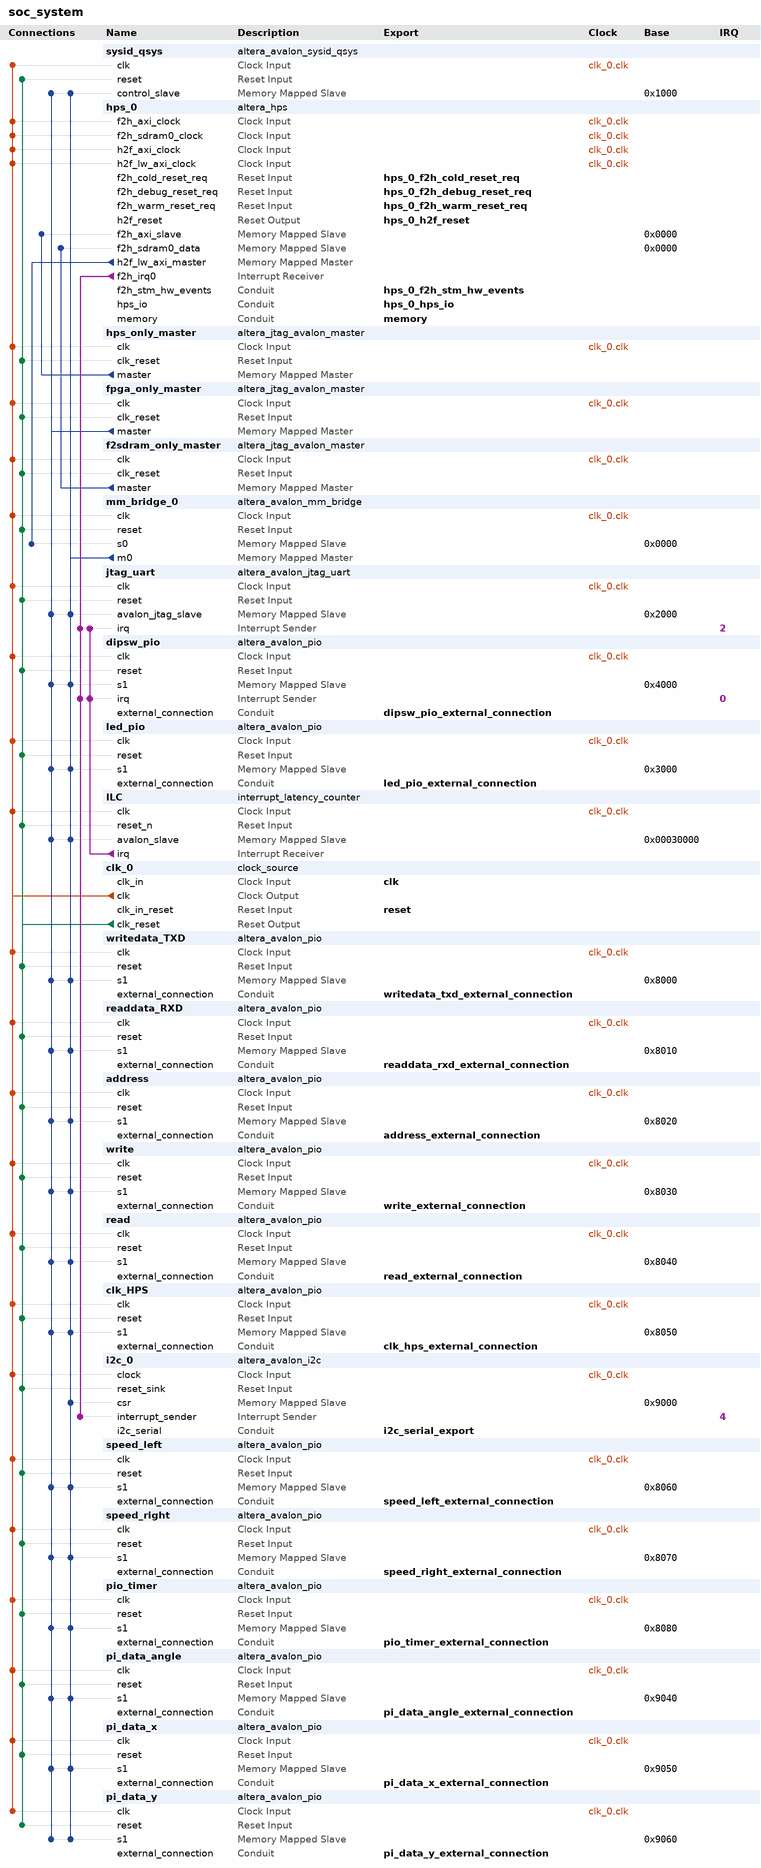
[diagram p0: system contents]
# Platform Designer (Qsys) system soc_system, Cyclone V 5CSEBA6U23I7
# Parameters at their usual value, and those the tool derives, are not listed.
package require -exact qsys 18.1
create_system soc_system
set_project_property DEVICE_FAMILY {Cyclone V}
set_project_property DEVICE 5CSEBA6U23I7

add_instance sysid_qsys altera_avalon_sysid_qsys 18.1
set_instance_parameter_value sysid_qsys id -1395322110

add_instance hps_0 altera_hps 18.1
set_instance_parameter_value hps_0 EMAC1_Mode RGMII
set_instance_parameter_value hps_0 EMAC1_PinMuxing {HPS I/O Set 0}
set_instance_parameter_value hps_0 F2SCLK_COLDRST_Enable true
set_instance_parameter_value hps_0 F2SCLK_DBGRST_Enable true
set_instance_parameter_value hps_0 F2SCLK_WARMRST_Enable true
set_instance_parameter_value hps_0 F2SDRAM_Type {Avalon-MM Bidirectional}
set_instance_parameter_value hps_0 F2SDRAM_Width 256
set_instance_parameter_value hps_0 F2SINTERRUPT_Enable true
set_instance_parameter_value hps_0 F2S_Width 2
set_instance_parameter_value hps_0 FPGA_PERIPHERAL_OUTPUT_CLOCK_FREQ_EMAC0_GTX_CLK 100
set_instance_parameter_value hps_0 FPGA_PERIPHERAL_OUTPUT_CLOCK_FREQ_EMAC0_MD_CLK 100.0
set_instance_parameter_value hps_0 FPGA_PERIPHERAL_OUTPUT_CLOCK_FREQ_EMAC1_GTX_CLK 100
set_instance_parameter_value hps_0 FPGA_PERIPHERAL_OUTPUT_CLOCK_FREQ_EMAC1_MD_CLK 100.0
set_instance_parameter_value hps_0 HPS_PROTOCOL DDR3
set_instance_parameter_value hps_0 I2C0_Mode I2C
set_instance_parameter_value hps_0 I2C0_PinMuxing {HPS I/O Set 0}
set_instance_parameter_value hps_0 I2C1_Mode I2C
set_instance_parameter_value hps_0 I2C1_PinMuxing {HPS I/O Set 0}
set_instance_parameter_value hps_0 LWH2F_Enable true
set_instance_parameter_value hps_0 MEM_BANKADDR_WIDTH 3
set_instance_parameter_value hps_0 MEM_CLK_FREQ 400.0
set_instance_parameter_value hps_0 MEM_COL_ADDR_WIDTH 10
set_instance_parameter_value hps_0 MEM_DQ_WIDTH 32
set_instance_parameter_value hps_0 MEM_DRV_STR RZQ/6
set_instance_parameter_value hps_0 MEM_ROW_ADDR_WIDTH 15
set_instance_parameter_value hps_0 MEM_RTT_NOM RZQ/6
set_instance_parameter_value hps_0 MEM_RTT_WR {Dynamic ODT off}
set_instance_parameter_value hps_0 MEM_TCL 7
set_instance_parameter_value hps_0 MEM_TFAW_NS 37.5
set_instance_parameter_value hps_0 MEM_TRAS_NS 35.0
set_instance_parameter_value hps_0 MEM_TRCD_NS 13.75
set_instance_parameter_value hps_0 MEM_TRFC_NS 300.0
set_instance_parameter_value hps_0 MEM_TRP_NS 13.75
set_instance_parameter_value hps_0 MEM_VENDOR Other
set_instance_parameter_value hps_0 MEM_WTCL 7
set_instance_parameter_value hps_0 QSPI_Mode N/A
set_instance_parameter_value hps_0 QSPI_PinMuxing Unused
set_instance_parameter_value hps_0 REF_CLK_FREQ 25.0
set_instance_parameter_value hps_0 S2FCLK_USER2CLK 4
set_instance_parameter_value hps_0 S2F_Width 2
set_instance_parameter_value hps_0 SDIO_Mode {4-bit Data}
set_instance_parameter_value hps_0 SDIO_PinMuxing {HPS I/O Set 0}
set_instance_parameter_value hps_0 SPIM1_Mode {Single Slave Select}
set_instance_parameter_value hps_0 SPIM1_PinMuxing {HPS I/O Set 0}
set_instance_parameter_value hps_0 STM_Enable true
set_instance_parameter_value hps_0 TIMING_BOARD_AC_SKEW 0.02
set_instance_parameter_value hps_0 TIMING_BOARD_AC_TO_CK_SKEW 0.0
set_instance_parameter_value hps_0 TIMING_BOARD_DQ_TO_DQS_SKEW 0.0
set_instance_parameter_value hps_0 TIMING_BOARD_MAX_CK_DELAY 0.6
set_instance_parameter_value hps_0 TIMING_BOARD_MAX_DQS_DELAY 0.6
set_instance_parameter_value hps_0 TIMING_BOARD_SKEW_BETWEEN_DQS 0.02
set_instance_parameter_value hps_0 TIMING_BOARD_SKEW_CKDQS_DIMM_MAX 0.01
set_instance_parameter_value hps_0 TIMING_BOARD_SKEW_CKDQS_DIMM_MIN -0.01
set_instance_parameter_value hps_0 TIMING_BOARD_SKEW_WITHIN_DQS 0.02
set_instance_parameter_value hps_0 TIMING_TDH 125
set_instance_parameter_value hps_0 TIMING_TDQSCK 400
set_instance_parameter_value hps_0 TIMING_TDQSQ 120
set_instance_parameter_value hps_0 TIMING_TDS 50
set_instance_parameter_value hps_0 TIMING_TIH 250
set_instance_parameter_value hps_0 TIMING_TIS 175
set_instance_parameter_value hps_0 TIMING_TQSH 0.38
set_instance_parameter_value hps_0 UART0_Mode {No Flow Control}
set_instance_parameter_value hps_0 UART0_PinMuxing {HPS I/O Set 0}
set_instance_parameter_value hps_0 USB1_Mode SDR
set_instance_parameter_value hps_0 USB1_PinMuxing {HPS I/O Set 0}
set_instance_parameter_value hps_0 desired_cfg_clk_mhz 100.0
set_instance_parameter_value hps_0 desired_qspi_clk_mhz 370.0

add_instance hps_only_master altera_jtag_avalon_master 18.1

add_instance fpga_only_master altera_jtag_avalon_master 18.1

add_instance f2sdram_only_master altera_jtag_avalon_master 18.1

add_instance mm_bridge_0 altera_avalon_mm_bridge 18.1
set_instance_parameter_value mm_bridge_0 ADDRESS_UNITS SYMBOLS
set_instance_parameter_value mm_bridge_0 ADDRESS_WIDTH 10
set_instance_parameter_value mm_bridge_0 DATA_WIDTH 32
set_instance_parameter_value mm_bridge_0 MAX_PENDING_RESPONSES 4
set_instance_parameter_value mm_bridge_0 USE_AUTO_ADDRESS_WIDTH 1

add_instance jtag_uart altera_avalon_jtag_uart 18.1
set_instance_parameter_value jtag_uart allowMultipleConnections true
set_instance_parameter_value jtag_uart simInteractiveOptions INTERACTIVE_ASCII_OUTPUT

add_instance dipsw_pio altera_avalon_pio 18.1
set_instance_parameter_value dipsw_pio bitClearingEdgeCapReg true
set_instance_parameter_value dipsw_pio captureEdge true
set_instance_parameter_value dipsw_pio direction Input
set_instance_parameter_value dipsw_pio edgeType ANY
set_instance_parameter_value dipsw_pio generateIRQ true
set_instance_parameter_value dipsw_pio irqType EDGE
set_instance_parameter_value dipsw_pio width 4

add_instance led_pio altera_avalon_pio 18.1
set_instance_parameter_value led_pio direction Output
set_instance_parameter_value led_pio resetValue 127
set_instance_parameter_value led_pio width 7

add_instance ILC interrupt_latency_counter 18.1
set_instance_parameter_value ILC IRQ_PORT_CNT 4

add_instance clk_0 clock_source 18.1
set_instance_parameter_value clk_0 clockFrequency 50000000

add_instance writedata_TXD altera_avalon_pio 18.1
set_instance_parameter_value writedata_TXD direction Output
set_instance_parameter_value writedata_TXD width 32

add_instance readdata_RXD altera_avalon_pio 18.1
set_instance_parameter_value readdata_RXD direction Input
set_instance_parameter_value readdata_RXD width 32

add_instance address altera_avalon_pio 18.1
set_instance_parameter_value address direction Output
set_instance_parameter_value address width 3

add_instance write altera_avalon_pio 18.1
set_instance_parameter_value write direction Output
set_instance_parameter_value write width 1

add_instance read altera_avalon_pio 18.1
set_instance_parameter_value read direction Output
set_instance_parameter_value read width 1

add_instance clk_HPS altera_avalon_pio 18.1
set_instance_parameter_value clk_HPS direction Output
set_instance_parameter_value clk_HPS width 1

add_instance i2c_0 altera_avalon_i2c 18.1
set_instance_parameter_value i2c_0 FIFO_DEPTH 4

add_instance speed_left altera_avalon_pio 18.1
set_instance_parameter_value speed_left direction Input
set_instance_parameter_value speed_left width 32

add_instance speed_right altera_avalon_pio 18.1
set_instance_parameter_value speed_right direction Input
set_instance_parameter_value speed_right width 32

add_instance pio_timer altera_avalon_pio 18.1
set_instance_parameter_value pio_timer direction Input
set_instance_parameter_value pio_timer width 32

add_instance pi_data_angle altera_avalon_pio 18.1
set_instance_parameter_value pi_data_angle direction Input
set_instance_parameter_value pi_data_angle width 32

add_instance pi_data_x altera_avalon_pio 18.1
set_instance_parameter_value pi_data_x direction Input
set_instance_parameter_value pi_data_x width 32

add_instance pi_data_y altera_avalon_pio 18.1
set_instance_parameter_value pi_data_y direction Input
set_instance_parameter_value pi_data_y width 32

# connections
add_connection clk_0.clk address.clk clock
add_connection clk_0.clk clk_HPS.clk clock
add_connection clk_0.clk dipsw_pio.clk clock
add_connection clk_0.clk f2sdram_only_master.clk clock
add_connection clk_0.clk fpga_only_master.clk clock
add_connection clk_0.clk hps_0.f2h_axi_clock clock
add_connection clk_0.clk hps_0.f2h_sdram0_clock clock
add_connection clk_0.clk hps_0.h2f_axi_clock clock
add_connection clk_0.clk hps_0.h2f_lw_axi_clock clock
add_connection clk_0.clk hps_only_master.clk clock
add_connection clk_0.clk i2c_0.clock clock
add_connection clk_0.clk ILC.clk clock
add_connection clk_0.clk jtag_uart.clk clock
add_connection clk_0.clk led_pio.clk clock
add_connection clk_0.clk mm_bridge_0.clk clock
add_connection clk_0.clk pi_data_angle.clk clock
add_connection clk_0.clk pi_data_x.clk clock
add_connection clk_0.clk pi_data_y.clk clock
add_connection clk_0.clk pio_timer.clk clock
add_connection clk_0.clk read.clk clock
add_connection clk_0.clk readdata_RXD.clk clock
add_connection clk_0.clk speed_left.clk clock
add_connection clk_0.clk speed_right.clk clock
add_connection clk_0.clk sysid_qsys.clk clock
add_connection clk_0.clk write.clk clock
add_connection clk_0.clk writedata_TXD.clk clock
add_connection clk_0.clk_reset address.reset reset
add_connection clk_0.clk_reset clk_HPS.reset reset
add_connection clk_0.clk_reset dipsw_pio.reset reset
add_connection clk_0.clk_reset f2sdram_only_master.clk_reset reset
add_connection clk_0.clk_reset fpga_only_master.clk_reset reset
add_connection clk_0.clk_reset hps_only_master.clk_reset reset
add_connection clk_0.clk_reset i2c_0.reset_sink reset
add_connection clk_0.clk_reset ILC.reset_n reset
add_connection clk_0.clk_reset jtag_uart.reset reset
add_connection clk_0.clk_reset led_pio.reset reset
add_connection clk_0.clk_reset mm_bridge_0.reset reset
add_connection clk_0.clk_reset pi_data_angle.reset reset
add_connection clk_0.clk_reset pi_data_x.reset reset
add_connection clk_0.clk_reset pi_data_y.reset reset
add_connection clk_0.clk_reset pio_timer.reset reset
add_connection clk_0.clk_reset read.reset reset
add_connection clk_0.clk_reset readdata_RXD.reset reset
add_connection clk_0.clk_reset speed_left.reset reset
add_connection clk_0.clk_reset speed_right.reset reset
add_connection clk_0.clk_reset sysid_qsys.reset reset
add_connection clk_0.clk_reset write.reset reset
add_connection clk_0.clk_reset writedata_TXD.reset reset
add_connection f2sdram_only_master.master hps_0.f2h_sdram0_data avalon
set_connection_parameter_value f2sdram_only_master.master/hps_0.f2h_sdram0_data baseAddress 0x0000
add_connection fpga_only_master.master address.s1 avalon
set_connection_parameter_value fpga_only_master.master/address.s1 baseAddress 0x8020
add_connection fpga_only_master.master clk_HPS.s1 avalon
set_connection_parameter_value fpga_only_master.master/clk_HPS.s1 baseAddress 0x8050
add_connection fpga_only_master.master dipsw_pio.s1 avalon
set_connection_parameter_value fpga_only_master.master/dipsw_pio.s1 baseAddress 0x4000
add_connection fpga_only_master.master ILC.avalon_slave avalon
set_connection_parameter_value fpga_only_master.master/ILC.avalon_slave baseAddress 0x00030000
add_connection fpga_only_master.master jtag_uart.avalon_jtag_slave avalon
set_connection_parameter_value fpga_only_master.master/jtag_uart.avalon_jtag_slave baseAddress 0x2000
add_connection fpga_only_master.master led_pio.s1 avalon
set_connection_parameter_value fpga_only_master.master/led_pio.s1 baseAddress 0x3000
add_connection fpga_only_master.master pi_data_angle.s1 avalon
set_connection_parameter_value fpga_only_master.master/pi_data_angle.s1 baseAddress 0x9040
add_connection fpga_only_master.master pi_data_x.s1 avalon
set_connection_parameter_value fpga_only_master.master/pi_data_x.s1 baseAddress 0x9050
add_connection fpga_only_master.master pi_data_y.s1 avalon
set_connection_parameter_value fpga_only_master.master/pi_data_y.s1 baseAddress 0x9060
add_connection fpga_only_master.master pio_timer.s1 avalon
set_connection_parameter_value fpga_only_master.master/pio_timer.s1 baseAddress 0x8080
add_connection fpga_only_master.master read.s1 avalon
set_connection_parameter_value fpga_only_master.master/read.s1 baseAddress 0x8040
add_connection fpga_only_master.master readdata_RXD.s1 avalon
set_connection_parameter_value fpga_only_master.master/readdata_RXD.s1 baseAddress 0x8010
add_connection fpga_only_master.master speed_left.s1 avalon
set_connection_parameter_value fpga_only_master.master/speed_left.s1 baseAddress 0x8060
add_connection fpga_only_master.master speed_right.s1 avalon
set_connection_parameter_value fpga_only_master.master/speed_right.s1 baseAddress 0x8070
add_connection fpga_only_master.master sysid_qsys.control_slave avalon
set_connection_parameter_value fpga_only_master.master/sysid_qsys.control_slave baseAddress 0x1000
add_connection fpga_only_master.master write.s1 avalon
set_connection_parameter_value fpga_only_master.master/write.s1 baseAddress 0x8030
add_connection fpga_only_master.master writedata_TXD.s1 avalon
set_connection_parameter_value fpga_only_master.master/writedata_TXD.s1 baseAddress 0x8000
add_connection hps_0.h2f_lw_axi_master mm_bridge_0.s0 avalon
set_connection_parameter_value hps_0.h2f_lw_axi_master/mm_bridge_0.s0 baseAddress 0x0000
add_connection hps_only_master.master hps_0.f2h_axi_slave avalon
set_connection_parameter_value hps_only_master.master/hps_0.f2h_axi_slave baseAddress 0x0000
add_connection mm_bridge_0.m0 address.s1 avalon
set_connection_parameter_value mm_bridge_0.m0/address.s1 baseAddress 0x8020
add_connection mm_bridge_0.m0 clk_HPS.s1 avalon
set_connection_parameter_value mm_bridge_0.m0/clk_HPS.s1 baseAddress 0x8050
add_connection mm_bridge_0.m0 dipsw_pio.s1 avalon
set_connection_parameter_value mm_bridge_0.m0/dipsw_pio.s1 baseAddress 0x4000
add_connection mm_bridge_0.m0 i2c_0.csr avalon
set_connection_parameter_value mm_bridge_0.m0/i2c_0.csr baseAddress 0x9000
add_connection mm_bridge_0.m0 ILC.avalon_slave avalon
set_connection_parameter_value mm_bridge_0.m0/ILC.avalon_slave baseAddress 0x00030000
add_connection mm_bridge_0.m0 jtag_uart.avalon_jtag_slave avalon
set_connection_parameter_value mm_bridge_0.m0/jtag_uart.avalon_jtag_slave baseAddress 0x2000
add_connection mm_bridge_0.m0 led_pio.s1 avalon
set_connection_parameter_value mm_bridge_0.m0/led_pio.s1 baseAddress 0x3000
add_connection mm_bridge_0.m0 pi_data_angle.s1 avalon
set_connection_parameter_value mm_bridge_0.m0/pi_data_angle.s1 baseAddress 0x9040
add_connection mm_bridge_0.m0 pi_data_x.s1 avalon
set_connection_parameter_value mm_bridge_0.m0/pi_data_x.s1 baseAddress 0x9050
add_connection mm_bridge_0.m0 pi_data_y.s1 avalon
set_connection_parameter_value mm_bridge_0.m0/pi_data_y.s1 baseAddress 0x9060
add_connection mm_bridge_0.m0 pio_timer.s1 avalon
set_connection_parameter_value mm_bridge_0.m0/pio_timer.s1 baseAddress 0x8080
add_connection mm_bridge_0.m0 read.s1 avalon
set_connection_parameter_value mm_bridge_0.m0/read.s1 baseAddress 0x8040
add_connection mm_bridge_0.m0 readdata_RXD.s1 avalon
set_connection_parameter_value mm_bridge_0.m0/readdata_RXD.s1 baseAddress 0x8010
add_connection mm_bridge_0.m0 speed_left.s1 avalon
set_connection_parameter_value mm_bridge_0.m0/speed_left.s1 baseAddress 0x8060
add_connection mm_bridge_0.m0 speed_right.s1 avalon
set_connection_parameter_value mm_bridge_0.m0/speed_right.s1 baseAddress 0x8070
add_connection mm_bridge_0.m0 sysid_qsys.control_slave avalon
set_connection_parameter_value mm_bridge_0.m0/sysid_qsys.control_slave baseAddress 0x1000
add_connection mm_bridge_0.m0 write.s1 avalon
set_connection_parameter_value mm_bridge_0.m0/write.s1 baseAddress 0x8030
add_connection mm_bridge_0.m0 writedata_TXD.s1 avalon
set_connection_parameter_value mm_bridge_0.m0/writedata_TXD.s1 baseAddress 0x8000
add_connection hps_0.f2h_irq0 dipsw_pio.irq interrupt
set_connection_parameter_value hps_0.f2h_irq0/dipsw_pio.irq irqNumber 0
add_connection hps_0.f2h_irq0 i2c_0.interrupt_sender interrupt
set_connection_parameter_value hps_0.f2h_irq0/i2c_0.interrupt_sender irqNumber 4
add_connection hps_0.f2h_irq0 jtag_uart.irq interrupt
set_connection_parameter_value hps_0.f2h_irq0/jtag_uart.irq irqNumber 2
add_connection ILC.irq dipsw_pio.irq interrupt
set_connection_parameter_value ILC.irq/dipsw_pio.irq irqNumber 0
add_connection ILC.irq jtag_uart.irq interrupt
set_connection_parameter_value ILC.irq/jtag_uart.irq irqNumber 2

# exported interfaces
add_interface address_external_connection conduit end
set_interface_property address_external_connection EXPORT_OF address.external_connection
add_interface clk clock sink
set_interface_property clk EXPORT_OF clk_0.clk_in
add_interface clk_hps_external_connection conduit end
set_interface_property clk_hps_external_connection EXPORT_OF clk_HPS.external_connection
add_interface dipsw_pio_external_connection conduit end
set_interface_property dipsw_pio_external_connection EXPORT_OF dipsw_pio.external_connection
add_interface hps_0_f2h_cold_reset_req reset sink
set_interface_property hps_0_f2h_cold_reset_req EXPORT_OF hps_0.f2h_cold_reset_req
add_interface hps_0_f2h_debug_reset_req reset sink
set_interface_property hps_0_f2h_debug_reset_req EXPORT_OF hps_0.f2h_debug_reset_req
add_interface hps_0_f2h_stm_hw_events conduit end
set_interface_property hps_0_f2h_stm_hw_events EXPORT_OF hps_0.f2h_stm_hw_events
add_interface hps_0_f2h_warm_reset_req reset sink
set_interface_property hps_0_f2h_warm_reset_req EXPORT_OF hps_0.f2h_warm_reset_req
add_interface hps_0_h2f_reset reset source
set_interface_property hps_0_h2f_reset EXPORT_OF hps_0.h2f_reset
add_interface hps_0_hps_io conduit end
set_interface_property hps_0_hps_io EXPORT_OF hps_0.hps_io
add_interface i2c_serial_export conduit end
set_interface_property i2c_serial_export EXPORT_OF i2c_0.i2c_serial
add_interface led_pio_external_connection conduit end
set_interface_property led_pio_external_connection EXPORT_OF led_pio.external_connection
add_interface memory conduit end
set_interface_property memory EXPORT_OF hps_0.memory
add_interface pi_data_angle_external_connection conduit end
set_interface_property pi_data_angle_external_connection EXPORT_OF pi_data_angle.external_connection
add_interface pi_data_x_external_connection conduit end
set_interface_property pi_data_x_external_connection EXPORT_OF pi_data_x.external_connection
add_interface pi_data_y_external_connection conduit end
set_interface_property pi_data_y_external_connection EXPORT_OF pi_data_y.external_connection
add_interface pio_timer_external_connection conduit end
set_interface_property pio_timer_external_connection EXPORT_OF pio_timer.external_connection
add_interface read_external_connection conduit end
set_interface_property read_external_connection EXPORT_OF read.external_connection
add_interface readdata_rxd_external_connection conduit end
set_interface_property readdata_rxd_external_connection EXPORT_OF readdata_RXD.external_connection
add_interface reset reset sink
set_interface_property reset EXPORT_OF clk_0.clk_in_reset
add_interface speed_left_external_connection conduit end
set_interface_property speed_left_external_connection EXPORT_OF speed_left.external_connection
add_interface speed_right_external_connection conduit end
set_interface_property speed_right_external_connection EXPORT_OF speed_right.external_connection
add_interface write_external_connection conduit end
set_interface_property write_external_connection EXPORT_OF write.external_connection
add_interface writedata_txd_external_connection conduit end
set_interface_property writedata_txd_external_connection EXPORT_OF writedata_TXD.external_connection

set_interconnect_requirement {$system} qsys_mm.clockCrossingAdapter HANDSHAKE
set_interconnect_requirement {$system} qsys_mm.maxAdditionalLatency 1

save_system soc_system.qsys
